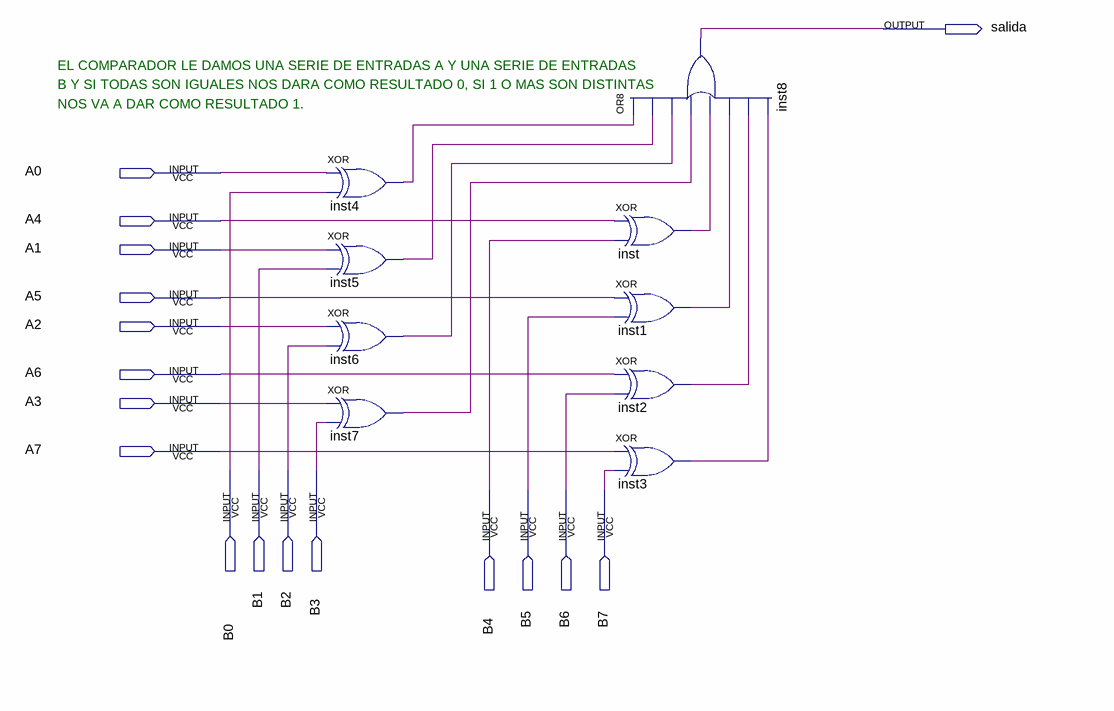
[diagram p0: schematic sheet]
// Quartus schematic Comparador.bdf as structural Verilog: 9 symbols, 17 pins
module Comparador (
  input  A0,
  input  A4,
  input  A1,
  input  A5,
  input  A2,
  input  A6,
  input  A3,
  input  A7,
  input  B0,
  input  B1,
  input  B2,
  input  B3,
  input  B4,
  input  B5,
  input  B6,
  input  B7,
  output salida
);

  wire inst1_out, inst2_out, inst3_out, inst4_out, inst5_out, inst6_out, inst7_out, inst_out;

  xor inst4 (inst4_out, A0, B0);
  xor inst5 (inst5_out, A1, B1);
  xor inst6 (inst6_out, A2, B2);
  xor inst7 (inst7_out, A3, B3);
  or inst8 (salida, inst4_out, inst5_out, inst6_out, inst7_out, inst_out, inst1_out, inst2_out, inst3_out);
  xor inst (inst_out, A4, B4);
  xor inst1 (inst1_out, A5, B5);
  xor inst2 (inst2_out, A6, B6);
  xor inst3 (inst3_out, A7, B7);

  // Notes on the sheet:
  //   EL COMPARADOR LE DAMOS UNA SERIE DE ENTRADAS A Y UNA SERIE DE ENTRADAS
  //   B Y SI TODAS SON IGUALES NOS DARA COMO RESULTADO 0, SI 1 O MAS SON DISTINTAS
  //   NOS VA A DAR COMO RESULTADO 1.
endmodule
